# EAGLE schematic Autopilot_remote_sender (EAGLE 9.5.1)
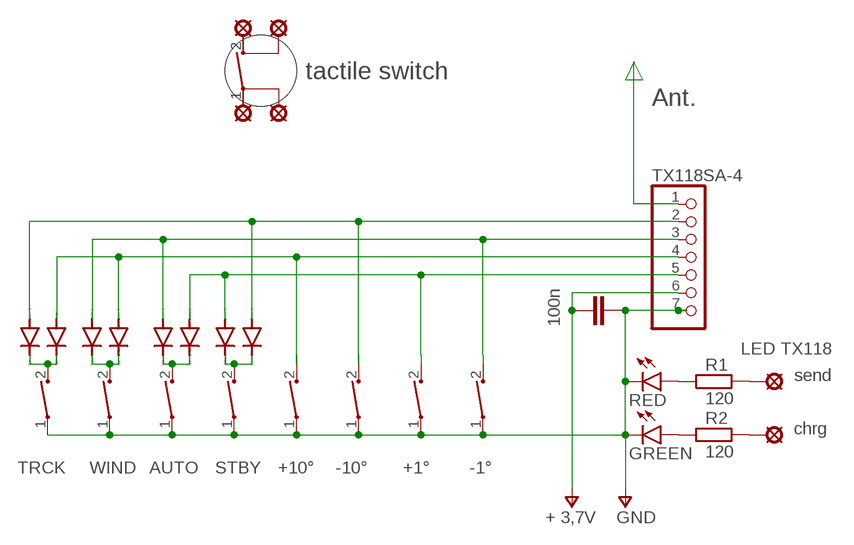
[diagram p0: schematic, sheet 1]

## Parts
+1°  CT10-XXXX-A2  [CT10-XXXX-A2]
+10°  CT10-XXXX-A2  [CT10-XXXX-A2]
-1°  CT10-XXXX-A2  [CT10-XXXX-A2]
-1°1  CT10-XXXX-A2  [CT10-XXXX-A2]
-10°  CT10-XXXX-A2  [CT10-XXXX-A2]
AUTO  CT10-XXXX-A2  [CT10-XXXX-A2]
C2  100n  C-EUC0805  [C0805]
D5  1N4148DO35-7  [DO35-7]
D6  1N4148DO35-7  [DO35-7]
D7  1N4148DO35-7  [DO35-7]
D8  1N4148DO35-7  [DO35-7]
D9  1N4148DO35-7  [DO35-7]
D10  1N4148DO35-7  [DO35-7]
D11  1N4148DO35-7  [DO35-7]
D12  1N4148DO35-7  [DO35-7]
GREEN  LAW51M  [W51]
LSP1  LSP10  [LSP10]
LSP2  LSP10  [LSP10]
LSP3  LSP10  [LSP10]
LSP4  LSP10  [LSP10]
LSP5  LSP10  [LSP10]
LSP6  LSP10  [LSP10]
R1  120  R-EU_R0805  [R0805]
R2  120  R-EU_R0805  [R0805]
RED  LAW51M  [W51]
STBY  CT10-XXXX-A2  [CT10-XXXX-A2]
TRCK  CT10-XXXX-A2  [CT10-XXXX-A2]
TX118SA-4  PINHD-1X7  [1X07]
WIND  CT10-XXXX-A2  [CT10-XXXX-A2]

## Nets
N$1: TX118SA-4.1
N$2: +1°.1 +10°.1 -1°.1 -10°.1 AUTO.1 C2.2 GREEN.C RED.C STBY.1 TRCK.1 TX118SA-4.7 WIND.1 ; supply symbol labelled V+
N$3: D11.C D12.C TRCK.2
N$4: D9.C D10.C WIND.2
N$5: AUTO.2 D7.C D8.C
N$6: D5.C D6.C STBY.2
N$7: +10°.2 D9.A D11.A TX118SA-4.4
N$8: -10°.2 D5.A D12.A TX118SA-4.2
N$9: +1°.2 D6.A D7.A TX118SA-4.5
N$10: -1°.2 D8.A D10.A TX118SA-4.3
N$11: LSP5.MP R1.2
N$12: R1.1 RED.A
N$13: LSP6.MP R2.2
N$16: GREEN.A R2.1
V+: C2.1 TX118SA-4.6
Unconnected: -1°1.1 -1°1.2 GREEN.TH@1(TH) GREEN.TH@2(TH) GREEN.TH@3(TH) LSP1.MP LSP2.MP LSP3.MP LSP4.MP RED.TH@1(TH) RED.TH@2(TH) RED.TH@3(TH)

## Notes on the sheet
- tactile switch
- Ant.
- LED TX118
- send
- chrg
- + 3,7V | GND

## Library data of the parts
+1° +10° -1° -1°1 -10° AUTO STBY TRCK WIND = switch-coto:CT10-XXXX-: CT10 Series Molded Switch Source: www.cotorelay.com .. Coto_Technology__CT10-1530-G1.pdf
C2 = rcl:C-EU: CAPACITOR, European symbol; SPICEPREFIX: C
D5-D12 = diode:1N4148: DIODE high speed (Philips)
GREEN RED = led:*W51M: Golden DRAGON® with Lens Enhanced Thinfilm LED Source: LA_LR_LY_W51M_Pb_free[1].pdf
LSP1-LSP6 = solpad:LSP10: SOLDER PAD drill 1.0 mm, distributor Buerklin, 12H555
R1 R2 = rcl:R-EU_: RESISTOR, European symbol; SPICEPREFIX: R
TX118SA-4 = pinhead:PINHD-1X7: PIN HEADER